# EAGLE design Kondensator-Lademodul (EAGLE 7.5.0)
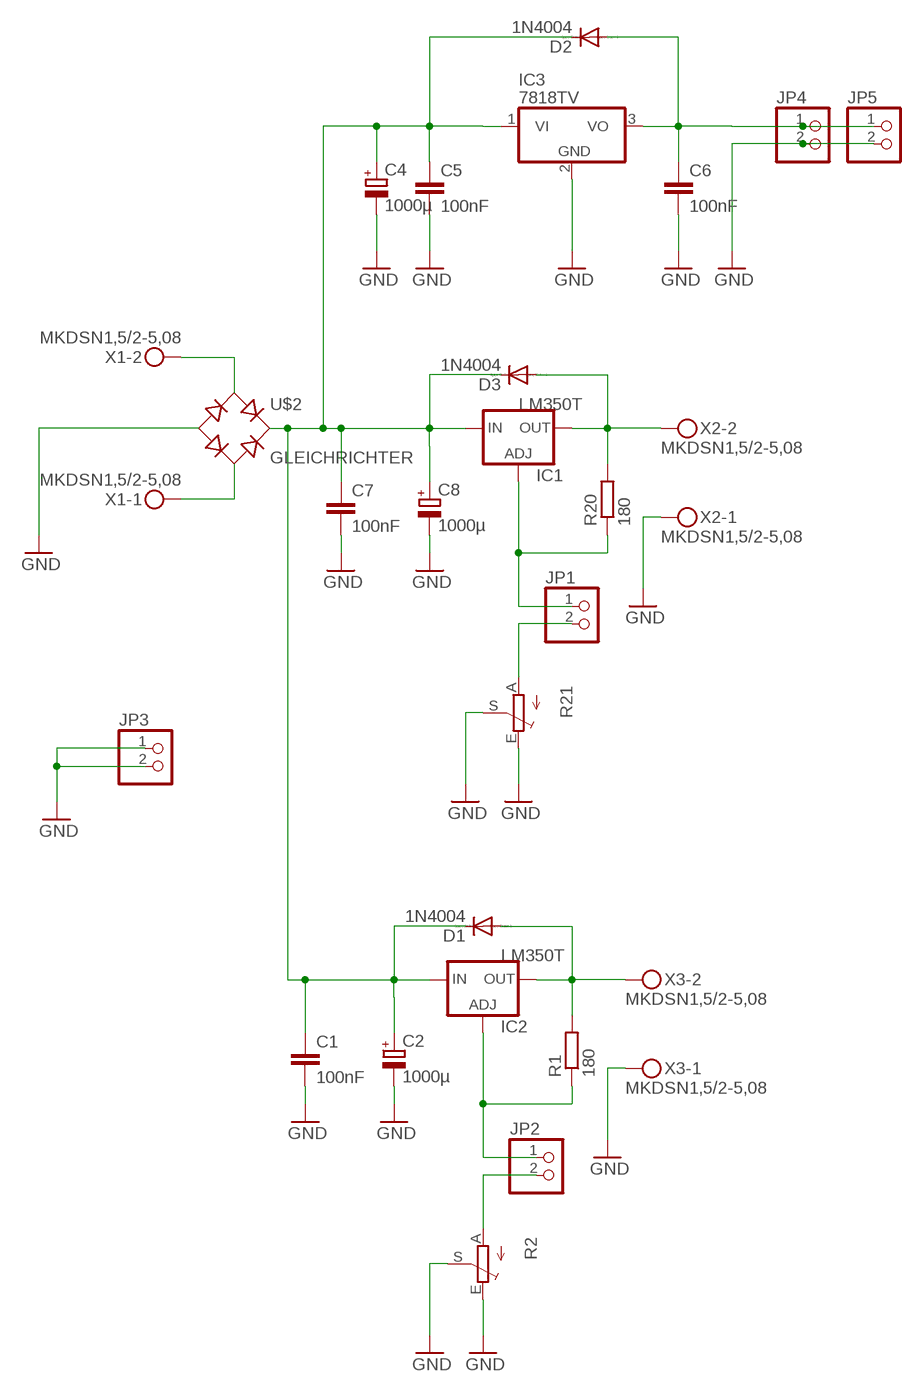
[diagram p0: schematic, sheet 1]

## Parts
C1  100nF  C-EUC0805  [C0805]
C2  1000µ  CPOL-EUE5-13  [E5-13]
C4  1000µ  CPOL-EUE5-13  [E5-13]
C5  100nF  C-EUC0805  [C0805]
C6  100nF  C-EUC0805  [C0805]
C7  100nF  C-EUC0805  [C0805]
C8  1000µ  CPOL-EUE5-13  [E5-13]
D1  1N4004  [DO41-10]
D2  1N4004  [DO41-10]
D3  1N4004  [DO41-10]
IC1  LM317TS  [317TS]
IC2  LM317TS  [317TS]
IC3  7818TV  7805TV  [TO220V]
JP1  PINHD-1X2  [1X02]
JP2  PINHD-1X2  [1X02]
JP3  PINHD-1X2  [1X02]
JP4  PINHD-1X2  [1X02]
JP5  PINHD-1X2  [1X02]
R1  180  R-EU_R1206  [R1206]
R2  TRIM_EU-PT10  [PT-10]
R20  180  R-EU_R1206  [R1206]
R21  TRIM_EU-PT10  [PT-10]
U$2  GLEICHRICHTER  [KBPC1]
X1  MKDSN1,5/2-5,08  [MKDSN1,5/2-5,08]
X2  MKDSN1,5/2-5,08  [MKDSN1,5/2-5,08]
X3  MKDSN1,5/2-5,08  [MKDSN1,5/2-5,08]

## Nets
GND: C1.2 C2.- C4.- C5.2 C6.2 C7.2 C8.- IC3.2(GND) JP3.1 JP3.2 JP4.2 JP5.2 R2.E R2.S R21.E R21.S U$2.- X2.1 X3.1
N$2: C6.1 D2.A IC3.3(VO) JP4.1 JP5.1
N$3: D1.A IC2.2(OUT) R1.2 X3.2
N$4: IC2.1(ADJ) JP2.1 R1.1
N$5: JP2.2 R2.A
N$17: C1.1 C2.+ C4.+ C5.1 C7.1 C8.+ D1.C D2.C D3.C IC1.3(IN) IC2.3(IN) IC3.1(VI) U$2.+
N$24: U$2.AC1 X1.2
N$25: U$2.AC2 X1.1
N$28: D3.A IC1.2(OUT) R20.2 X2.2
N$29: JP1.2 R21.A
N$30: IC1.1(ADJ) JP1.1 R20.1

## Notes on the sheet
- LM350T
- LM350T

## Library data of the parts
C1 C5-C7 = rcl:C-EU: CAPACITOR, European symbol
C2 C4 C8 = rcl:CPOL-EU: POLARIZED CAPACITOR, European symbol
D1-D3 = diode:1N4004: DIODE general purpose rectifier, 1 A
IC1 IC2 = v-reg:LM317TS: VOLTAGE REGULATOR
IC3 = linear:78*: Positive VOLTAGE REGULATOR Source: http://cache.national.com/ds/LM/LM78L05.pdf http://www.fairchildsemi.com/ds/LM/LM7805.pdf
JP1-JP5 = pinhead:PINHD-1X2: PIN HEADER
R1 R20 = rcl:R-EU_: RESISTOR, European symbol
R2 R21 = pot:TRIM_EU-: POTENTIOMETER
U$2 = Gleichrichter:GLEICHRICHTER
X1-X3 = con-phoenix-508:MKDSN1,5/2-5,08: MKDSN 1,5/ 2-5,08 Printklemme Nennstrom: 13,5 A Nennspannung: 250 V Rastermaß: 5,08 mm Polzahl: 2 Anschlussart: Schraubanschluss Montage: Löten Anschlussrichtung Leiter/Platine: 0 ° Artikelnummer: 1729128 Source: http://eshop.phoenixcontact.com .. 1729128.pdf

## Board
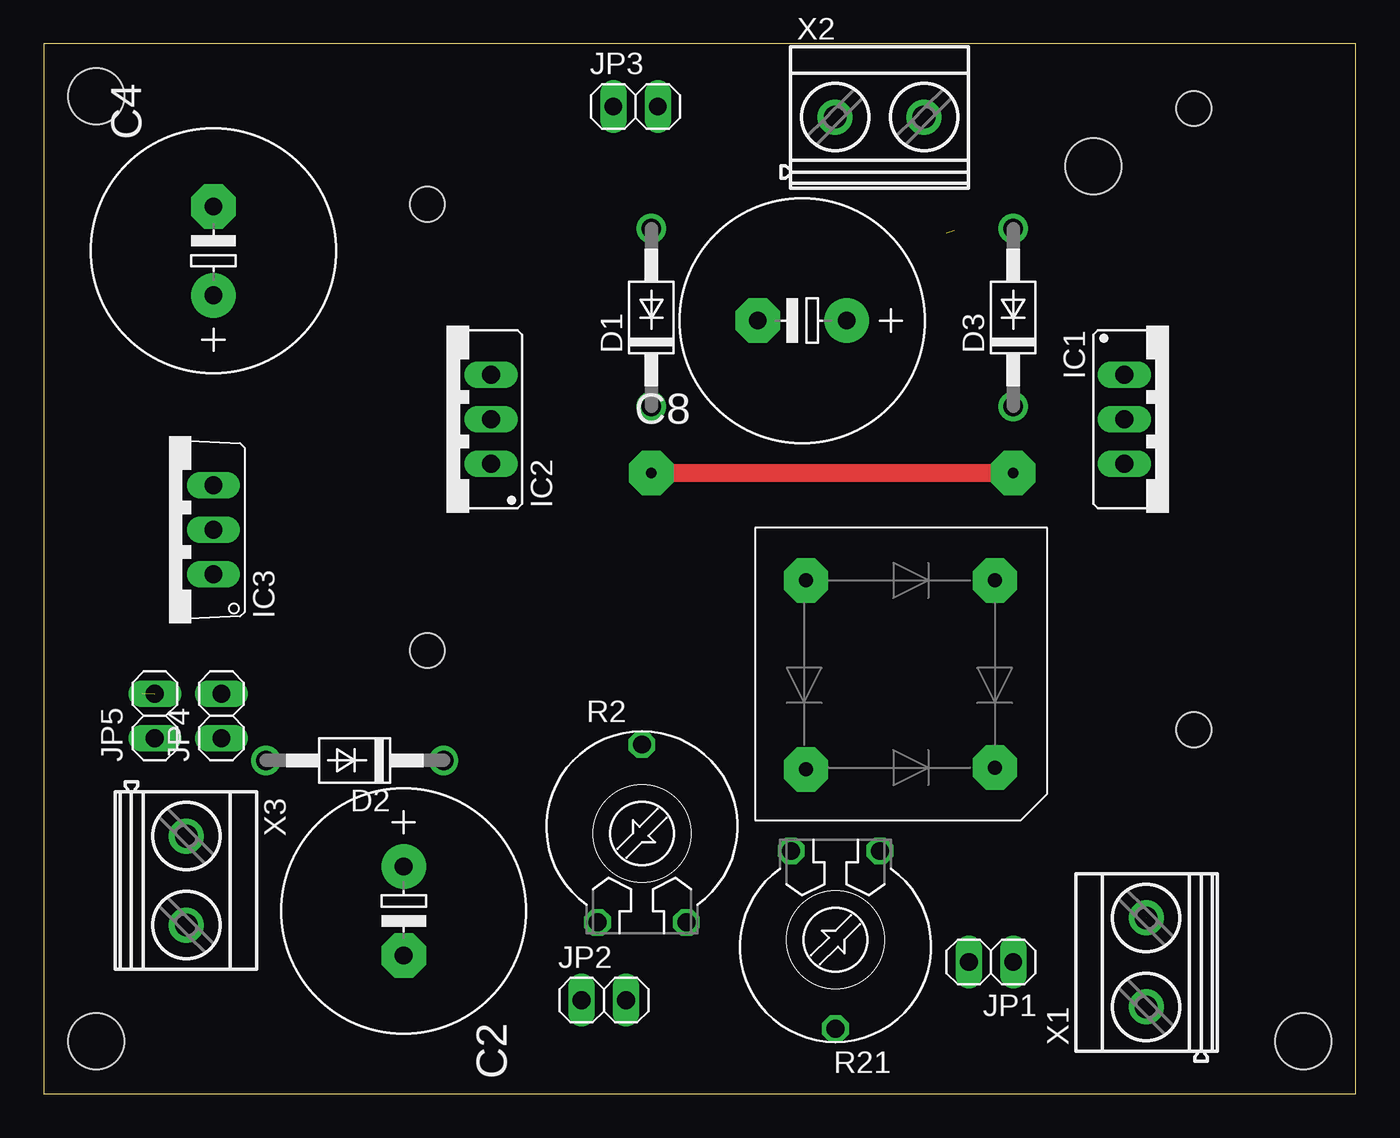
[diagram p1: board, top side]
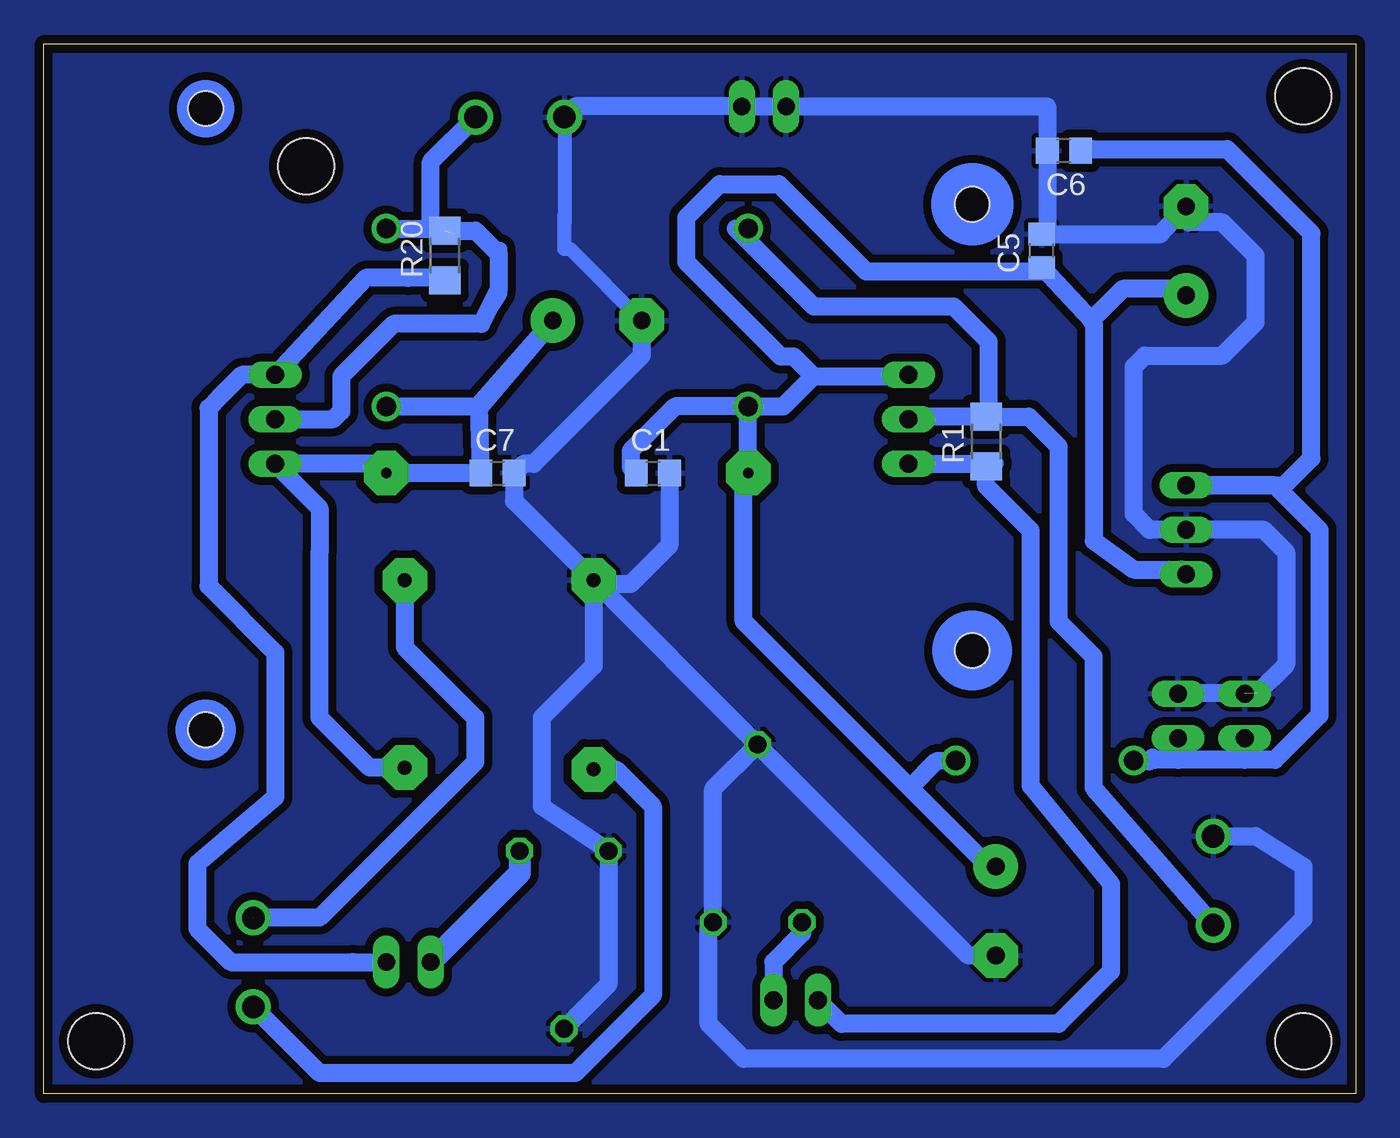
[diagram p2: board, bottom side, seen from below]

Size 75 x 60 mm. Coordinates in mm from the lower left corner, seen from the top.
Outline: 0,60 0,0 75,0 75,60 0,60
Copper layers (1*16): Top 0.035mm / dielectric 1.5mm / Bottom 0.035mm
Design rules "default *": minimum track width 10mil, minimum drill 24mil, track to track 18mil, track to pad 18mil, pad to pad 18mil, via to via 18mil, smd to smd 8mil, copper to edge 20mil, drill to drill 8mil, minimum pad ring 10mil, minimum via ring 8mil, stop-mask expansion 4mil, vias tented up to drill 0mil, thermal gap 10mil
Holes 3.2 mm at 3,57 72,3 60,53 3,3
Holes 2 mm at 65.74,56.3 65.74,20.8 21.93,50.83 21.93,25.33
tKeepout: 25 lines

### Footprints (pad centres in the part's own frame; a part is rotated, then mirrored left to right if it is on the bottom)
C0805 = smd 1.3 x 1.5: 1 -0.95,0; 2 0.95,0
E5-13 = drill 1.016 pad 2.54: + -2.54,0 | drill 1.016 pad 2.54 octagon: - 2.54,0
DO41-10 = drill 1.118: A 5.08,0; C -5.08,0
317TS = drill 1.016 long: 1 -2.54,-2.54; 2 0,-2.54; 3 2.54,-2.54
TO220V = drill 1.016 long: 1 -2.54,-2.54; 2 0,-2.54; 3 2.54,-2.54
1X02 = drill 1.016 long: 1 -1.27,0; 2 1.27,0
R1206 = smd 1.6 x 1.803: 1 -1.422,0; 2 1.422,0
PT-10 = drill 1.016 octagon: A -2.54,-5.08; E 2.54,-5.08; S 0,5.08
KBPC1 = drill 0.8 pad 2.54 octagon: + -5.3,5.4; - 5.5,-5.3; AC1 -5.3,-5.3; AC2 5.5,5.5
MKDSN1,5/2-5,08 = drill 1.3 pad 2: 1 -2.561,0.025; 2 2.519,0.025

### Placement (x,y rotation side)
C1  40.18,35.47 0 bottom
C2  20.57,10.44 270 top
C4  9.7,48.16 90 top
C5  17.95,48.16 90 bottom
C6  16.68,53.88 180 bottom
C7  49.07,35.47 0 bottom
C8  43.35,44.18 180 top
D1  34.73,44.35 90 top
D2  17.78,19.05 180 top
D3  55.42,44.35 90 top
IC1  64.31,38.55 270 top
IC2  23.04,38.55 90 top
IC3  7.16,32.23 90 top
JP1  54.15,7.53 180 top
JP2  32.02,5.35 0 top
JP3  33.83,56.42 0 top
JP4  10.16,21.59 90 top
JP5  6.35,21.59 90 top
R1  21.13,37.27 90 bottom
R2  34.2,14.88 0 top
R20  52.07,47.9 90 bottom
R21  45.26,8.79 180 top
U$2  49.07,24.04 180 top
X1  63.04,7.53 90 top
X2  47.8,55.78 0 top
X3  8.13,12.16 270 top

### Tracks (layer width: path | path; a pad name or v marks a point on that pad's centre or on a via)
GND  (1 unrouted)
  Bottom 0.813: C8.- 44.9,48.26 45.24,48.26 45.24,50.16 | X2.1 45.24,50.16 | 45.24,50.16 45.24,49.7
  Bottom 1.016: U$2.- 48.12,33.88 C7.2 47.59,36 47,36 40.81,42.19 C8.- | U$2.- 43.57,24.45 46.53,21.5 46.53,20.23 46.53,16.41 R21.E 42.72,6.25 R21.S | 39.23,31.34 C1.2 39.23,31.34 | 39.23,31.34 41.45,29.11 | 41.45,29.11 43.35,29.11 U$2.- | 34.62,20.38 R2.S 36.73,17.41 R2.E 37,9.53 37,4 35,2 11,2 3,10 3,13 5.72,14.72 X3.1 | 34.62,20.38 U$2.- | 39.23,31.34 41.45,29.11 | C5.2 17.64,49.44 C6.2 17.64,56.42 32.42,56.42 JP3.1 JP3.2 44.63,56.42 X2.1 | C5.2 11.16,49.12 C4.- 9.56,49.8 7.62,49.8 5.71,47.9 5.71,44.09 7.62,42.18 12.06,42.18 12.7,41.55 12.7,40.91 12.7,33.13 11.79,32.23 IC3.2 5.25,32.23 3.98,30.95 3.98,24.52 5.62,22.89 10.19,22.89 JP4.2 | 18.07,49 C5.2 | C2.- 22.14,7.9 34.62,20.38
  pour Bottom: 81.83,66.66 81.83,-9.62 -8.79,-9.62 -8.7,66.94
N$1
  pour Bottom: -6,64 79,64 79,-6 -5,-6
N$2
  Bottom 1.016: C6.1 15.06,53.98 7.35,53.98 2.54,49.16 2.54,36.3 4.08,34.77 IC3.3 4.62,34.77 2.08,32.23 2.08,21.62 4.62,19.08 6.35,19.08 | 6.35,19.08 10.16,19.08 | 10.16,19.08 11.53,19.08 11.6,19.22 11.83,19 D2.A | JP5.1 6.35,20.4 6.35,19.08 | JP4.1 10.16,20.23 10.16,19.08
N$3
  Bottom 1.016: R1.2 25.42,38.7 IC2.2 | D1.A 35.44,49.44 31,45 23,45 21,43 21,38.83 R1.2 | R1.2 18.7,38.7 17,37 17,27 15,25 15,17.49 X3.2
N$4
  Bottom 1.016: IC2.1 20.65,36.01 R1.1 21.13,34.73 18.59,32.2 18.59,32.04 18.59,17.59 14,12 14,7 17,4 29.4,4 JP2.1
N$5
  Bottom 1.016: R2.A 31.66,9.16 33.29,7.53 JP2.2
N$17  (via drill 0.6 pad 2.54)
  Top 1.016: v55.42,35.47 v34.73,35.47
  Bottom 1.016: D3.C 51.61,39.27 50.04,39.27 C8.+ 50.13,39.35 C7.1 | C7.1 v55.42,35.47 | U$2.+ 56.37,18.64 59.23,21.5 59.23,30.93 59.23,33.47 IC1.3 55.96,36.01 v55.42,35.47 | D1.C 38.91,39.27 41.45,36.73 41.45,35.78 C1.1 | C7.1 v55.42,35.47 | D1.C v34.73,35.47 35,35.2 35,27 25.5,17.5 | 15.12,44.2 C5.1 18.17,47 | 15.12,44.2 14.97,44.04 14.97,31.59 12.7,29.95 9.97,29.95 IC3.1 | C4.+ 9.76,46.39 10.16,45.99 13.33,45.99 15.12,44.2 | 18.17,47 21,47 28,47 32.98,51.98 36.37,51.98 38.27,50.07 38.27,47.53 32.88,42.13 32.13,42.13 31,41 | 18.17,47 18,47 18.17,47 | D1.C 32.73,39.27 31,41 | 31,41 25.66,41 IC2.3 | C2.+ 20.98,12.98 25.5,17.5 | D2.C 24,19 25.5,17.5
N$24  (1 unrouted)
  Bottom 1.016: U$2.AC1 54.37,25.52 50.34,21.5 50.34,18.95 59.23,10.06 63.04,10.06
N$25
  Bottom 1.016: U$2.AC2 42.3,18.54 40.18,16.41 40.18,5.62 44.62,1.18 59.23,1.18 X1.1
N$28  (1 unrouted)
  Bottom 0.813: 50,44 48.9,45.72 48.9,48.26
  Bottom 1.016: D3.A 52.88,49.44 | 52.88,49.44 51.61,49.16 | 52.88,49.44 52.88,53.25 X2.2 | R20.2 50.32,49.32 49,48 49,46 50,44 55,44 58,41 58,39 58.45,38.55 IC1.2
N$29
  Bottom 1.27: R21.A 47.8,12.61 JP1.2
N$30
  Bottom 1.016: R20.1 52.07,46.62 52.24,46.62 54.15,46.62 56.59,46.62 IC1.1 63.67,41.09 64.94,39.81 65.58,39.18 65.58,29.02 61.77,25.21 61.77,16.95 66.22,13.14 66.22,9.43 64.31,7.53 57.33,7.53 JP1.1
(copper drawn outside any net)
  shapes: Bottom circle x4

### Text on the board
Document: C Hi | GND | C low | 24V ~ IN | Poti Hi | Poti low